# EAGLE design 6_LIN (EAGLE 7.6.0)
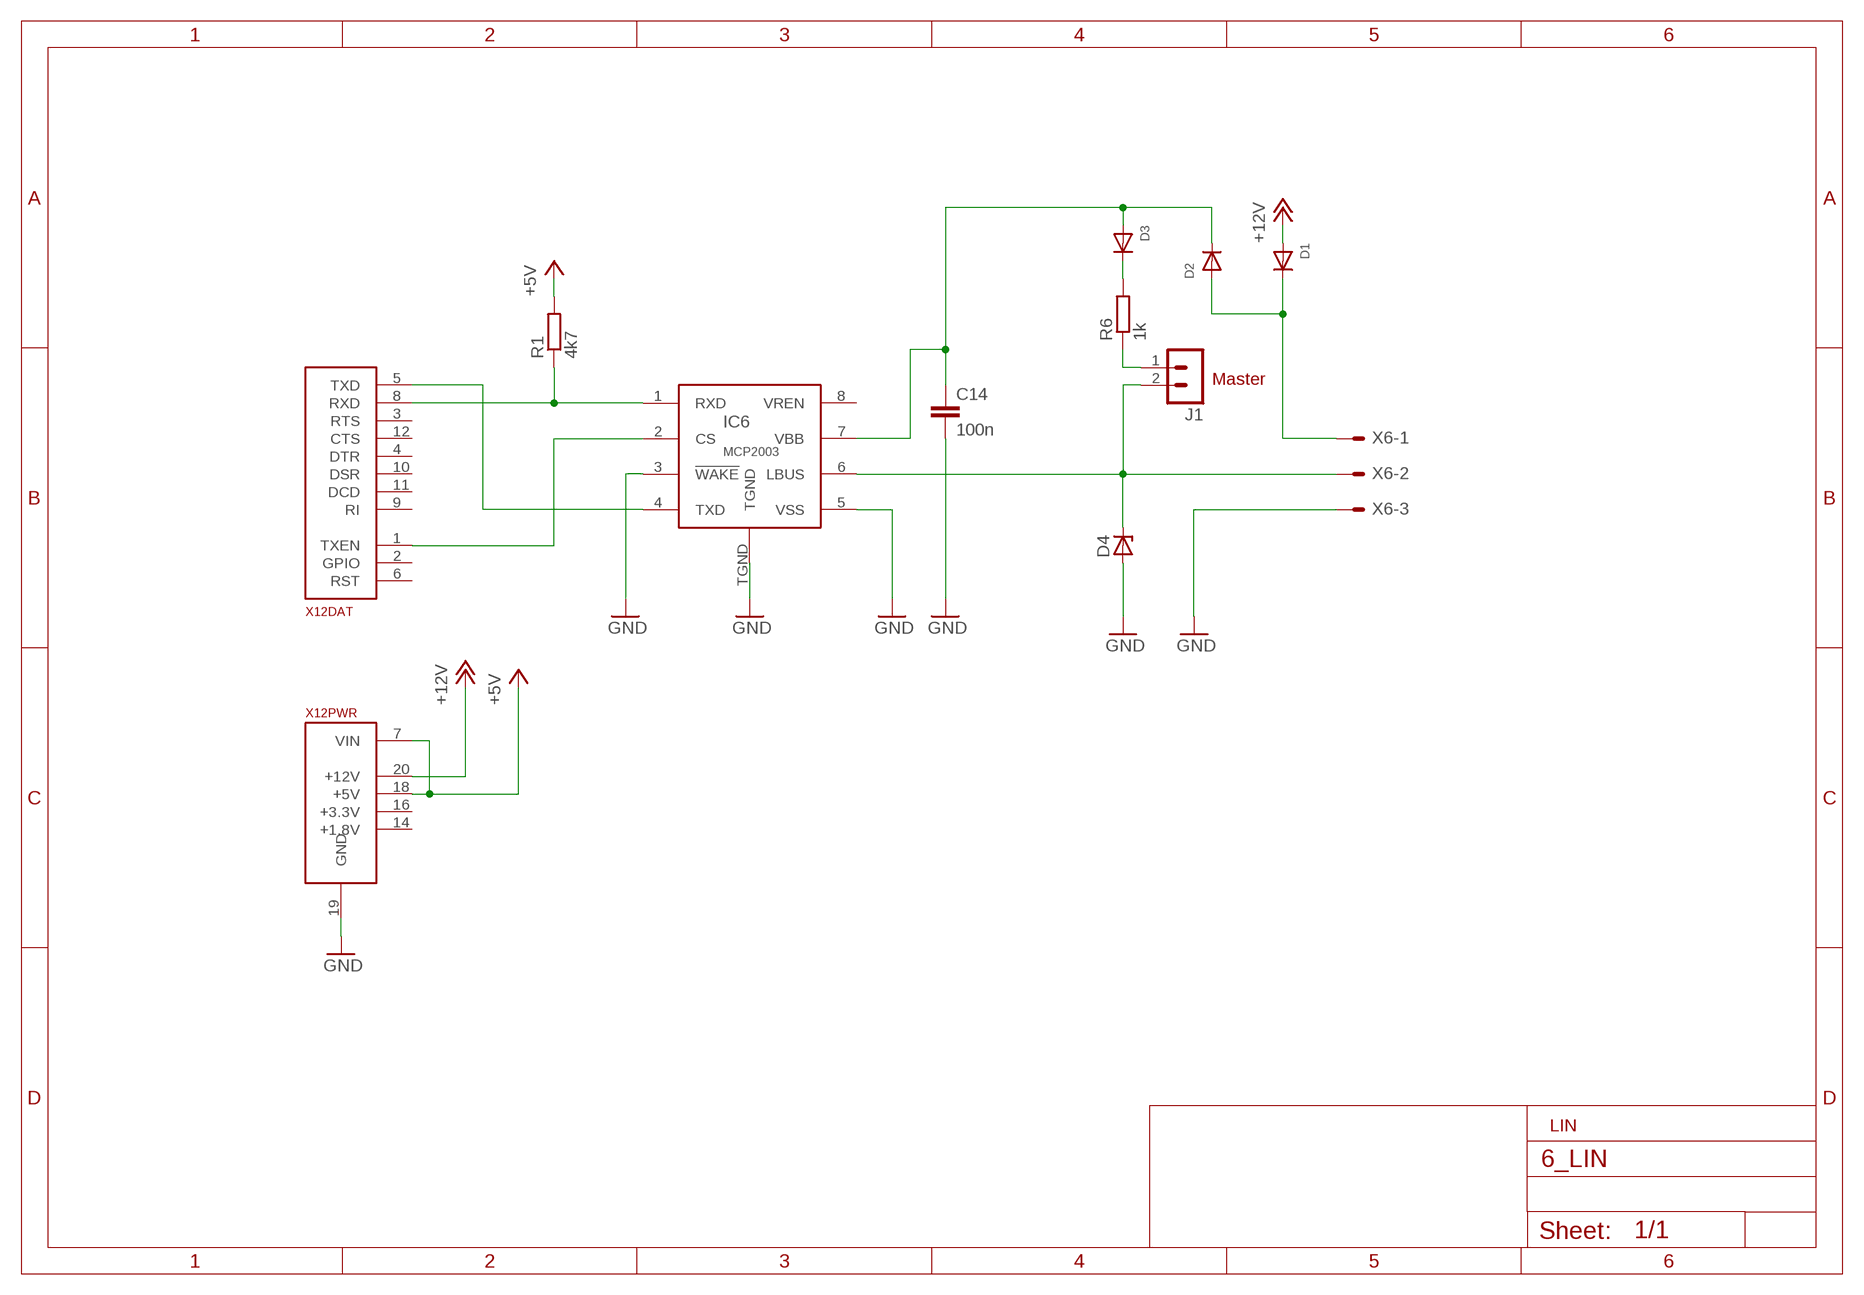
[diagram p0: schematic, sheet 1]

## Parts
C14  100n  C-EUC0805  [C0805]
D1  DIODESOD-123  [SOD-123]
D2  DIODESOD-123  [SOD-123]
D3  DIODESOD-123  [SOD-123]
D4  ZENER-DIODESOT23  [SOT23]
IC6  MCP2003  [SOIC8T]
J1  MA02-1W  [MA02-W]
R1  4k7  R-EU_R0805  [R0805]
R6  1k  R-EU_R0805  [R0805]
X6  AKL18X-03W  [AKL182-03]
X12  ALLSERIALD  [DAUGHTER-THT]

## Nets
+5V: R1.2 X12.7(PWR:VIN) X12.18(PWR:+5V)
+12V: D1.A X12.20(PWR:+12V)
GND: C14.2 D4.1(A) IC6.3(!WAKE) IC6.5(VSS) IC6.TGND X6.P$3 X12.19(PWR:GND)
N$1: D1.C D2.A X6.P$1
N$2: C14.1 D2.C D3.A IC6.7(VBB)
N$73: D4.3(C) IC6.6(LBUS) J1.2 X6.P$2
N$74: J1.1 R6.1
N$75: D3.C R6.2
N$77: IC6.4(TXD) X12.5(DAT:TXD)
N$78: IC6.2(CS) X12.1(DAT:TXEN)
N$79: IC6.1(RXD) R1.1 X12.8(DAT:RXD)
Unconnected: IC6.8(VREN) X12.2(DAT:GPIO) X12.3(DAT:RTS) X12.4(DAT:DTR) X12.6(DAT:RST) X12.9(DAT:RI) X12.10(DAT:DSR) X12.11(DAT:DCD) X12.12(DAT:CTS) X12.13(USB:VUSB) X12.14(PWR:+1.8V) X12.15(USB:D+) X12.16(PWR:+3.3V) X12.17(USB:D-)

## Notes on the sheet
- Master
- LIN

## Library data of the parts
C14 = rcl:C-EU: CAPACITOR, European symbol
D1-D3 = microbuilder:DIODE: Diode SMA Model Volts Amps Type Vf Vr Digikey # Notes SSA34-E3 40V 3A Schottky 480mV @ 3A 200uA @ 40V SSA34-E3/61TGITR-ND CDBA120-G 20V 1A Schottky 500mV @ 1A 500uA @ 20V 641-1014-6-ND REEL MBRA210 10V 2A Schottky 350mV @ 2A 700uA @ 10V MBRA210LT3 SOD-123 Model Volts Amps Type Vf Vr Order # Notes BAT54T1G 30V 200mA Schottky 800mV @ 200mA 2uA @ 25V BAT54T1GOSTR-ND B0530W 30V 500mA Schottky 430mV @ 500mA 130uA @ 30V B0530W-FDICT-ND REEL MBR120 1A 20V Schottky 340mV @ 1A MBR120VLSFT1GOSCT-ND SOD-323 Model Volts Amps Type Vf Vr Order # Notes PMEG2005EJ 20V 500mA Schottky 355mV @ 500mA 568-4110-1-ND ZLLS410 10V 570mA Schottky 380mV @ 570mA ZLLS410CT-ND 1N4148WS 75V 150mA Silicon/Simple 1V 1N4148WSFSCT-ND REEL SOD-523 Model Volts Amps Type Vf Vr Order # Notes BAT54XV2 30V 200mA Schottky 0.8V @ 100mA BAT54XV2CT-ND TB751S 30V 30mA Schottky RB751S-40TE61CT-ND SOT23-R/W (R = Solder Paste/Reflow Ovens, W = Hand-Soldering) Model Volts Amps Type Vf Vr Order # Notes BAT54FILM 40V 300mA Schottky 497-7162-1-ND
D4 = diode:ZENER-DIODE: Z-Diode
IC6 = freetronics-jon:MCP2003
J1 = con-lstb:MA02-1W
R1 R6 = rcl:R-EU_: RESISTOR, European symbol
X6 = con-riacon_akl:AKL18X-03: Riacon AKL18X Steckverbinder 3-Pol Grid = 3,5mm
X12 = AllSerial:ALLSERIAL

## Board
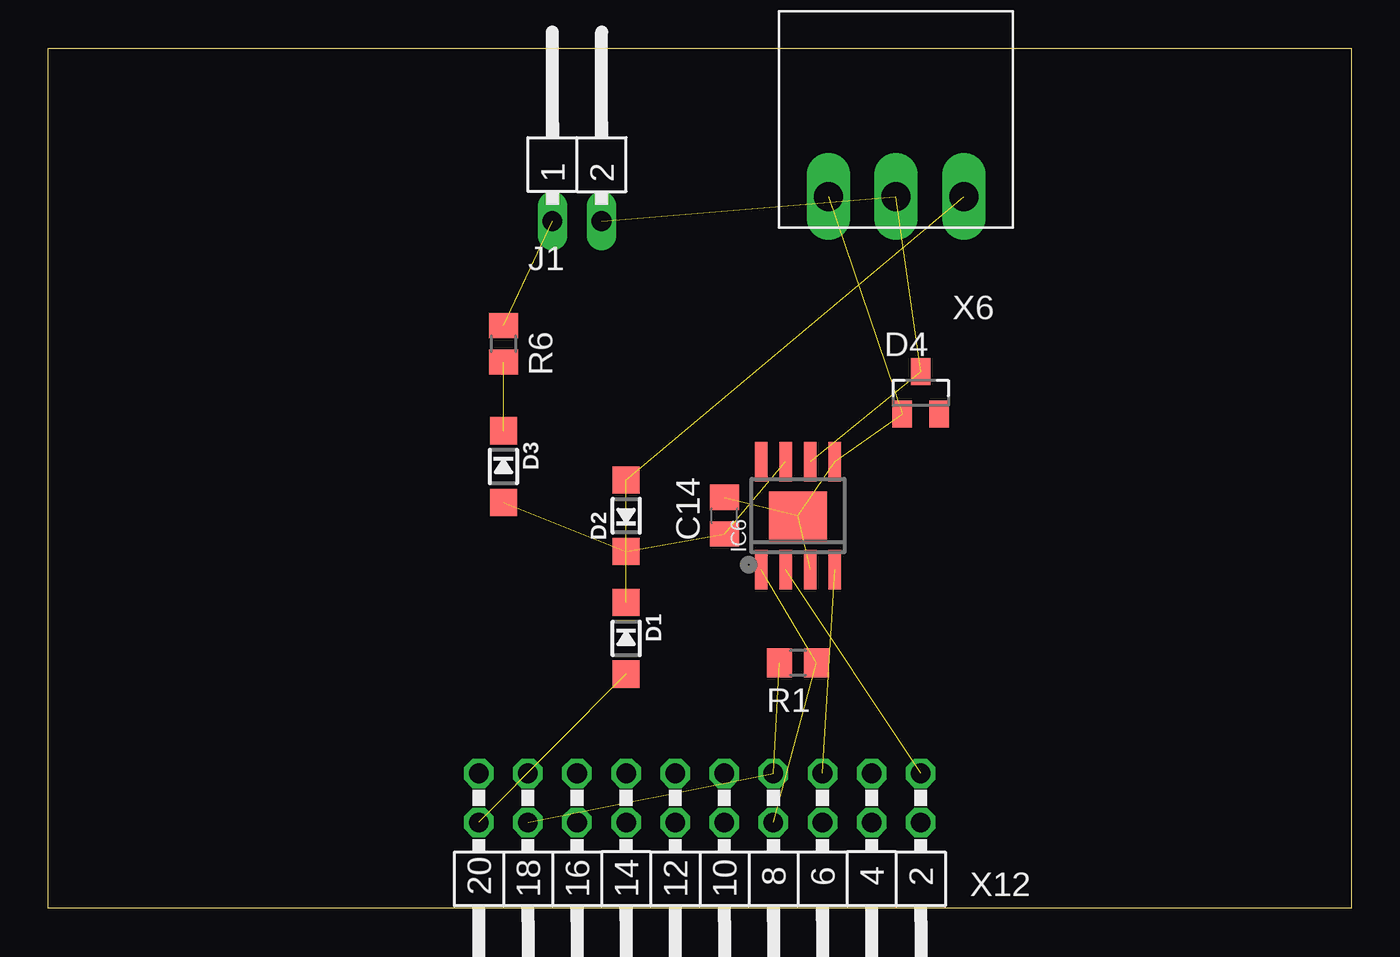
[diagram p1: board, top side]
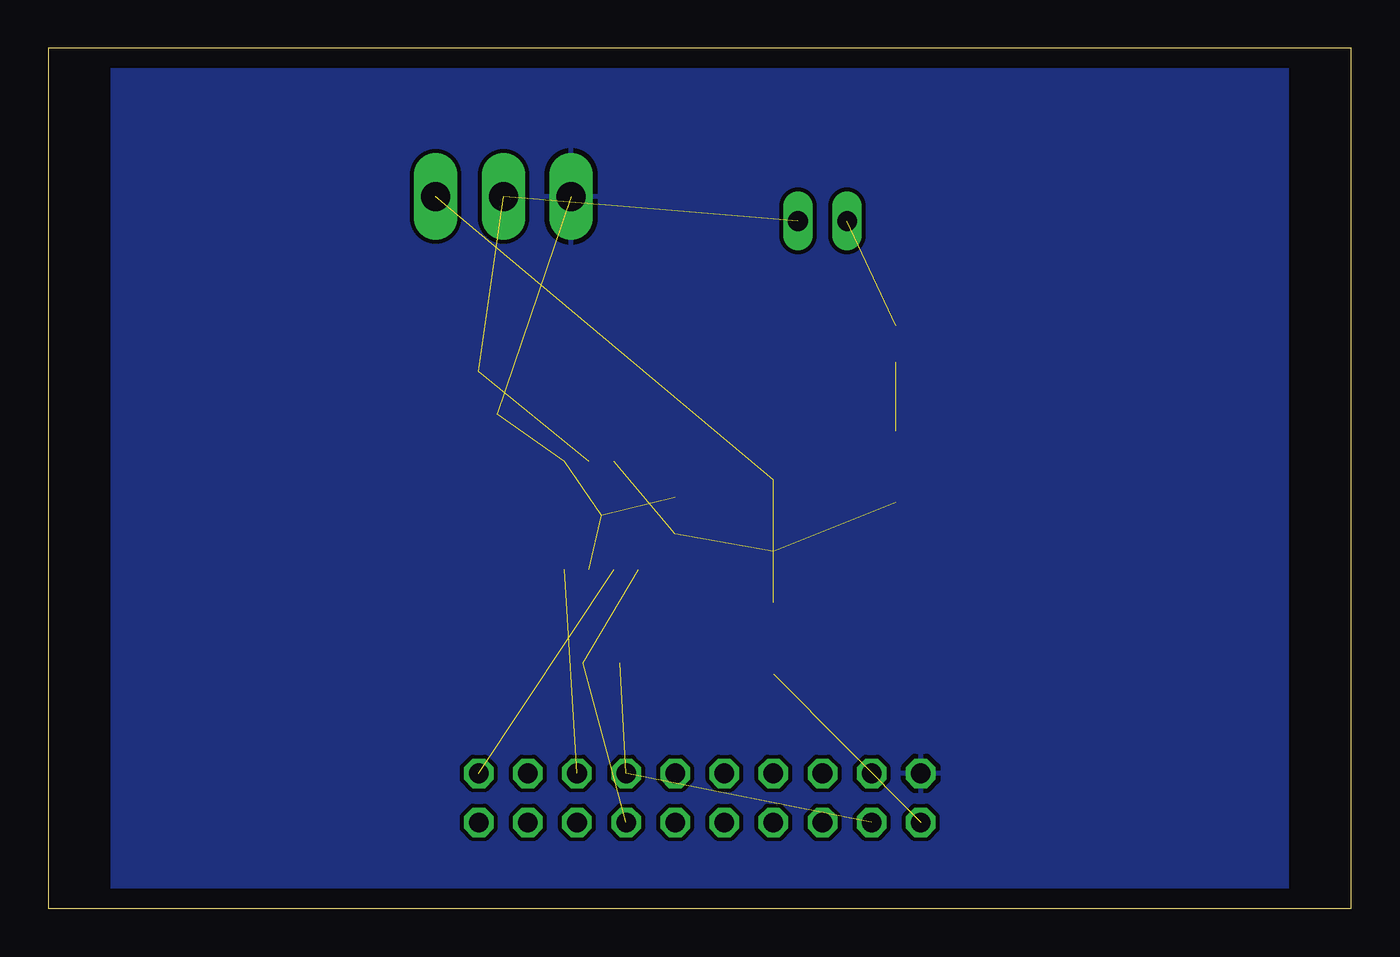
[diagram p2: board, bottom side, seen from below]

Size 67.4 x 44.5 mm. Coordinates in mm from the lower left corner, seen from the top.
Copper layers (1*16): Top 0.035mm / dielectric 1.5mm / Bottom 0.035mm
Design rules "default *": minimum track width 10mil, minimum drill 24mil, track to track 8mil, track to pad 8mil, pad to pad 8mil, via to via 8mil, smd to smd 8mil, copper to edge 40mil, drill to drill 8mil, minimum pad ring 10mil, minimum via ring 8mil, stop-mask expansion 4mil, vias tented up to drill 0.3mm, thermal gap 10mil

### Footprints (pad centres in the part's own frame; a part is rotated, then mirrored left to right if it is on the bottom)
C0805 = smd 1.3 x 1.5: 1 -0.95,0; 2 0.95,0
SOD-123 = smd 1.4 x 1.4: A 1.85,0; C -1.85,0
SOT23 = smd 1 x 1.4: 1 -0.95,-1.1; 2 0.95,-1.1; 3 0,1.1
SOIC8T = smd 2.032 x 0.66: 1 -2.794,1.905; 2 -2.794,0.635; 3 -2.794,-0.635; 4 -2.794,-1.905; 5 2.794,-1.905; 6 2.794,-0.635; 7 2.794,0.635; 8 2.794,1.905 | smd 2.489 x 2.997: TGND 0,0
MA02-W = drill 1.016 long: 1 -1.27,0; 2 1.27,0
R0805 = smd 1.3 x 1.5: 1 -0.95,0; 2 0.95,0
AKL182-03 = drill 1.5 pad 2.184 long: P$1 -3.5,0; P$2 0,0; P$3 3.5,0
DAUGHTER-THT = drill 1.016 octagon: 1 11.43,6.985; 2 11.43,4.445; 3 8.89,6.985; 4 8.89,4.445; 5 6.35,6.985; 6 6.35,4.445; 7 3.81,6.985; 8 3.81,4.445; 9 1.27,6.985; 10 1.27,4.445; 11 -1.27,6.985; 12 -1.27,4.445; 13 -3.81,6.985; 14 -3.81,4.445; 15 -6.35,6.985; 16 -6.35,4.445; 17 -8.89,6.985; 18 -8.89,4.445; 19 -11.43,6.985; 20 -11.43,4.445

### Placement (x,y rotation side)
C14  34.97,20.32 90 top
D1  29.89,13.97 270 top
D2  29.89,20.32 90 top
D3  23.54,22.86 270 top
D4  45.13,26.67 0 top
IC6  38.78,20.32 90 top
J1  27.35,35.56 0 top
R1  38.78,12.7 180 top
R6  23.54,29.21 270 top
X6  43.86,36.83 180 top
X12  33.7,0 0 top

### Tracks (layer width: path | path; a pad name or v marks a point on that pad's centre or on a via)
+5V  (2 unrouted)
+12V  (1 unrouted)
GND  (5 unrouted)
  pour Bottom: -0.59,44.45 67.99,44.45 67.99,0 -0.59,0
N$1  (2 unrouted)
N$2  (3 unrouted)
N$73  (3 unrouted)
N$74  (1 unrouted)
N$75  (1 unrouted)
N$77  (1 unrouted)
N$78  (1 unrouted)
N$79  (2 unrouted)